# EAGLE design buffer (EAGLE 9.6.2)
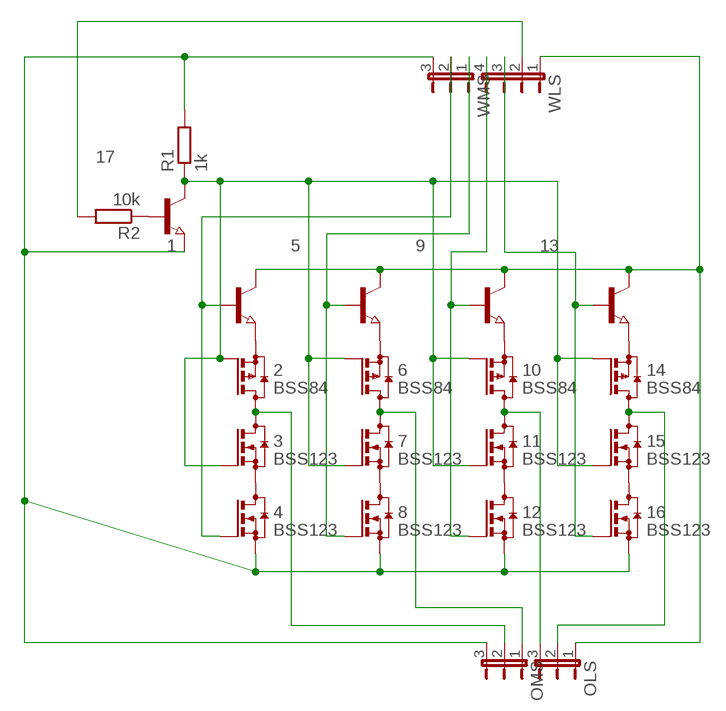
[diagram p0: schematic, sheet 1]

## Parts
1  NPN-TRANSISTOR_SOT23  [SOT23]
2  BSS84  [SOT23]
3  BSS123  [SOT23]
4  BSS123  [SOT23]
5  NPN-TRANSISTOR_SOT23  [SOT23]
6  BSS84  [SOT23]
7  BSS123  [SOT23]
8  BSS123  [SOT23]
9  NPN-TRANSISTOR_SOT23  [SOT23]
10  BSS84  [SOT23]
11  BSS123  [SOT23]
12  BSS123  [SOT23]
13  NPN-TRANSISTOR_SOT23  [SOT23]
14  BSS84  [SOT23]
15  BSS123  [SOT23]
16  BSS123  [SOT23]
17  NPN-TRANSISTOR_SOT23  [SOT23]
OLS  JP2E  [JP2]
OMS  JP2E  [JP2]
R1  1k  R-EU_R1206  [R1206]
R2  10k  R-EU_R1206  [R1206]
WLS  JP4E  [JP4]
WMS  JP2E  [JP2]

## Nets
N$1: 13.2(E) 14.2(S)
N$2: 14.3(D) 15.3(D) OLS.2
N$3: 15.2(S) 16.3(D)
N$4: 1.3(C) 5.3(C) 9.3(C) 13.3(C) OLS.1 WLS.1
N$5: 13.1(B) 16.1(G) WLS.3
N$7: 4.2(S) 8.2(S) 12.2(S) 16.2(S) 17.2(E) OMS.3 R1.2 WMS.3
N$8: 9.2(E) 10.2(S)
N$9: 10.3(D) 11.3(D) OLS.3
N$10: 11.2(S) 12.3(D)
N$11: 9.1(B) 12.1(G) WLS.4
N$13: 5.2(E) 6.2(S)
N$14: 6.3(D) 7.3(D) OMS.1
N$15: 7.2(S) 8.3(D)
N$16: 5.1(B) 8.1(G) WMS.1
N$18: 1.2(E) 2.2(S)
N$19: 2.3(D) 3.3(D) OMS.2
N$20: 3.2(S) 4.3(D)
N$21: 1.1(B) 4.1(G) WMS.2
N$23: 2.1(G) 3.1(G) 6.1(G) 7.1(G) 10.1(G) 11.1(G) 14.1(G) 15.1(G) 17.3(C) R1.1
N$24: 17.1(B) R2.1
N$25: R2.2 WLS.2

## Library data of the parts
1 5 9 13 17 = semicon-smd-ipc:NPN-TRANSISTOR_: NPN TRANSISTOR
2 6 10 14 = transistor-small-signal:BSS84: P-CHANNEL MOS FET
3 4 7 8 11 12 15 16 = transistor-small-signal:BSS123: N-CHANNEL MOS FET
OLS OMS WMS = jumper:JP2E: JUMPER
R1 R2 = rcl:R-EU_: RESISTOR, European symbol; SPICEPREFIX: R
WLS = jumper:JP4E: JUMPER

## Net classes
0 default: width 1.27 mm

## Board
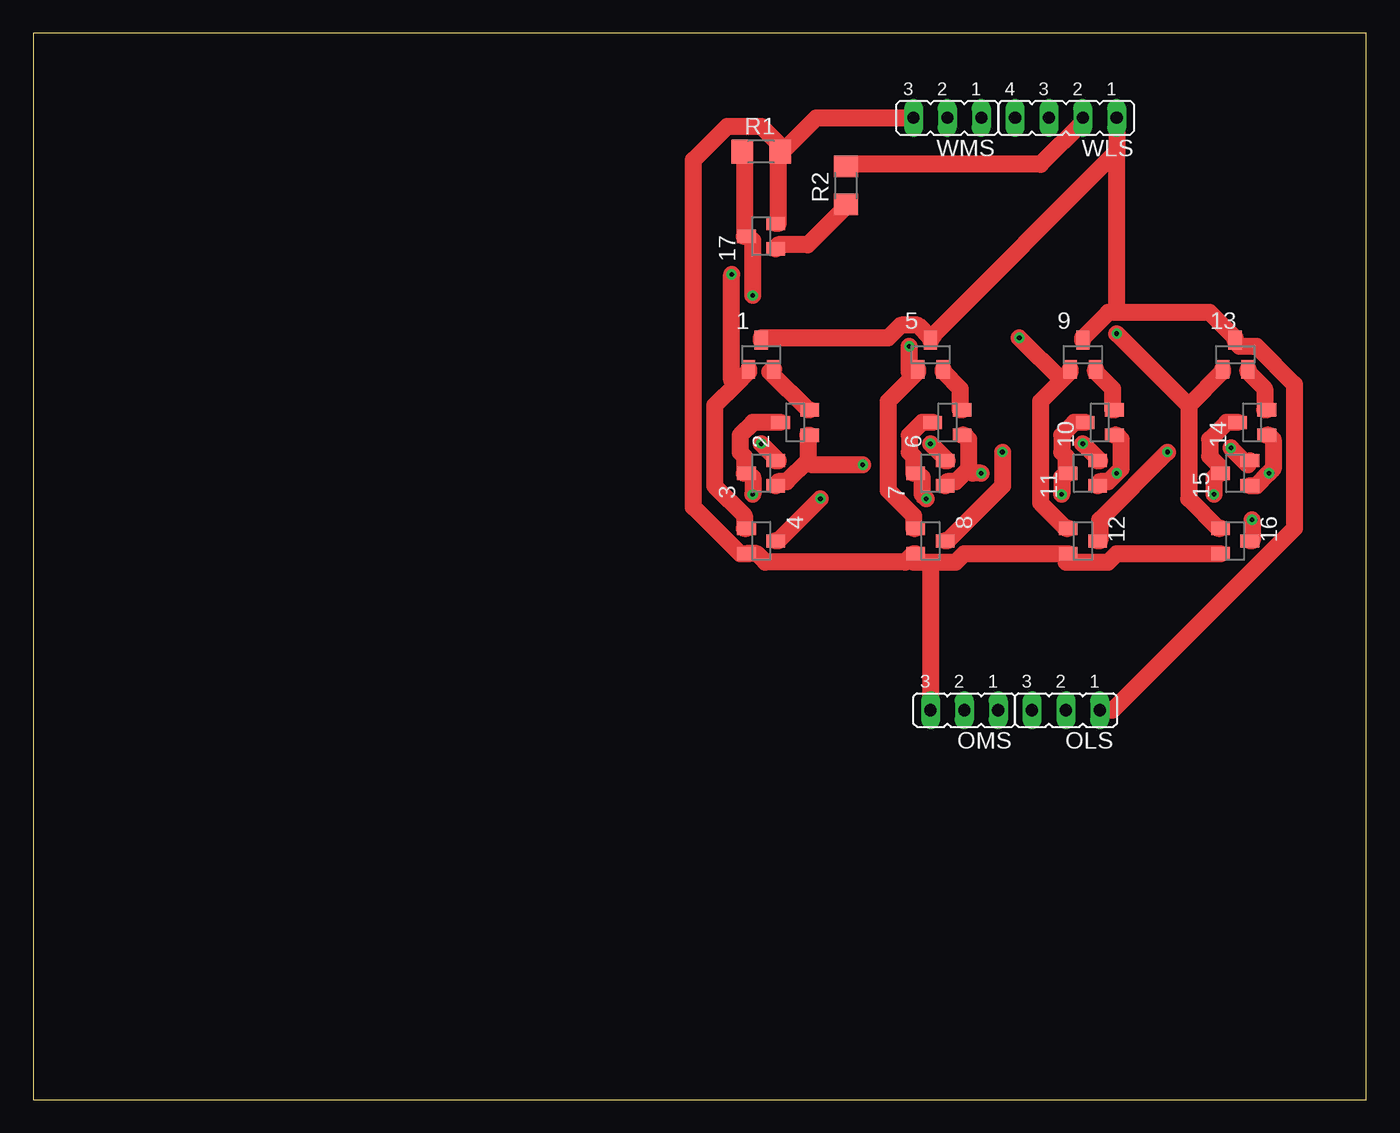
[diagram p1: board, top side]
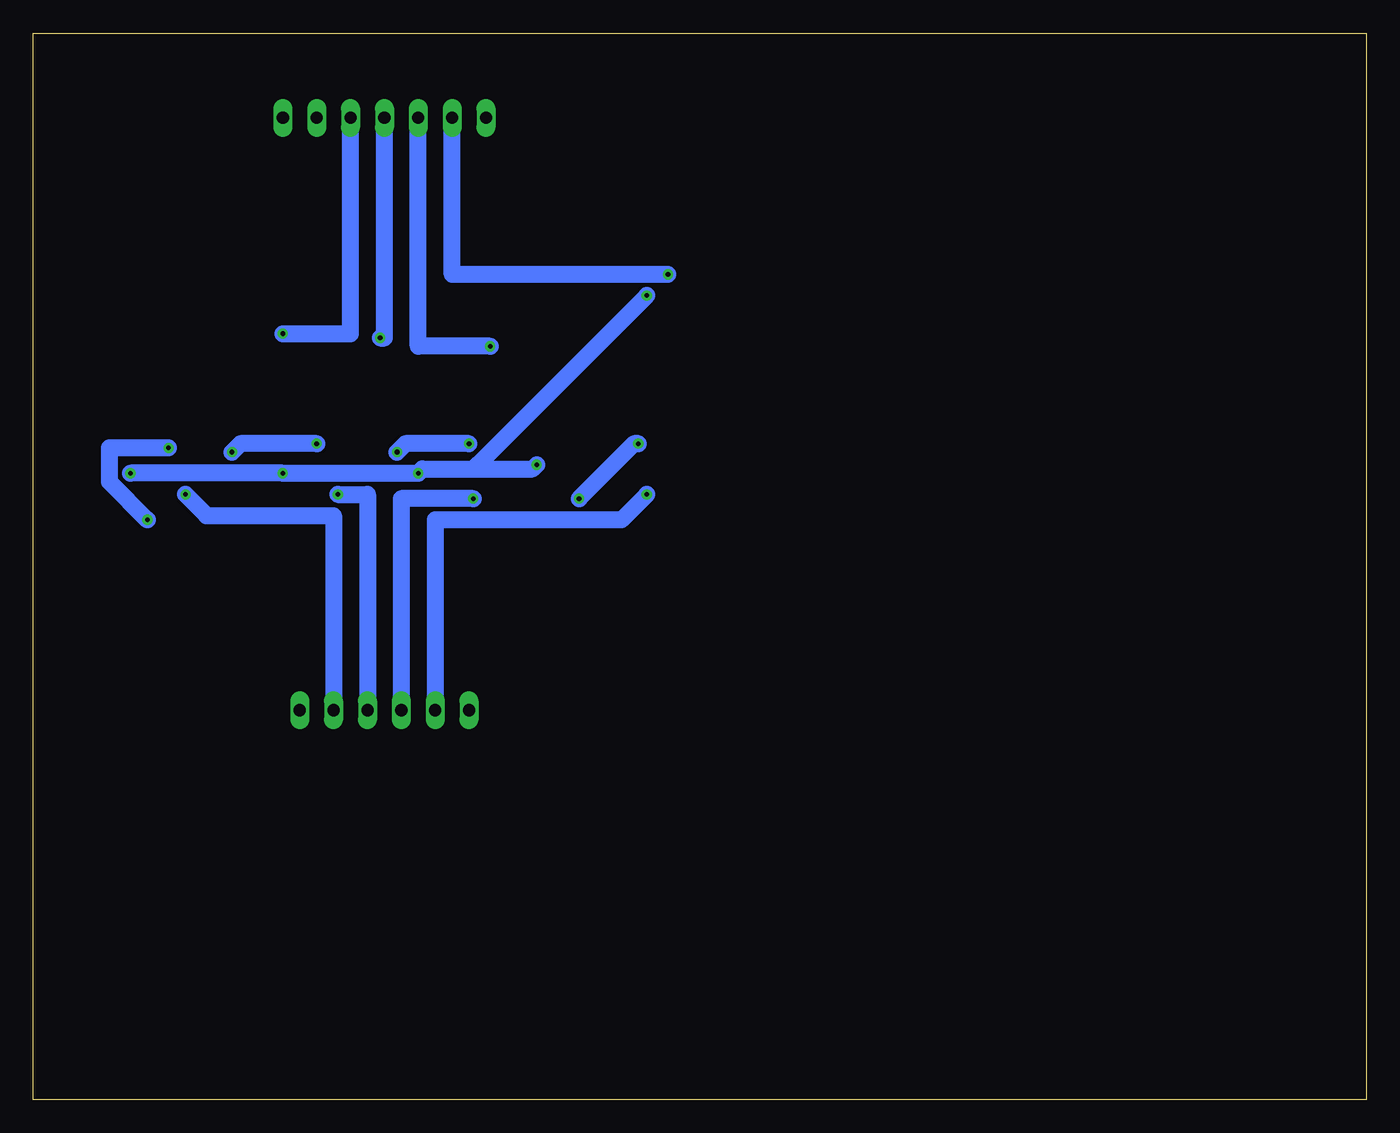
[diagram p2: board, bottom side, seen from below]

Size 100 x 80 mm. Coordinates in mm from the lower left corner, seen from the top.
Outline: 0,0 100,0 100,80 0,80 0,0
Copper layers (1*16): Top 0.035mm / dielectric 1.5mm / Bottom 0.035mm
Design rules "default": minimum track width 6mil, minimum drill 0.35mm, track to track 6mil, track to pad 6mil, pad to pad 6mil, via to via 6mil, smd to smd 6mil, copper to edge 40mil, drill to drill 6mil, minimum pad ring 10mil, minimum via ring 8mil, stop-mask expansion 4mil, vias tented up to drill 0mil, thermal gap 10mil

### Footprints (pad centres in the part's own frame; a part is rotated, then mirrored left to right if it is on the bottom)
SOT23 = smd 1 x 1.4: 1 -0.95,-1.1; 2 0.95,-1.1; 3 0,1.1
JP2 = drill 0.914 long: 1 -2.54,0; 2 0,0; 3 2.54,0
R1206 = smd 1.6 x 1.803: 1 -1.422,0; 2 1.422,0
JP4 = drill 0.914 long: 1 -3.81,0; 2 -1.27,0; 3 1.27,0; 4 3.81,0

### Placement (x,y rotation side)
1  54.61,55.88 0 top
2  57.15,50.8 90 top
3  54.61,46.99 90 top
4  54.61,41.91 270 top
5  67.31,55.88 0 top
6  68.58,50.8 90 top
7  67.31,46.99 90 top
8  67.31,41.91 270 top
9  78.74,55.88 0 top
10  80.01,50.8 90 top
11  78.74,46.99 90 top
12  78.74,41.91 270 top
13  90.17,55.88 0 top
14  91.44,50.8 90 top
15  90.17,46.99 90 top
16  90.17,41.91 270 top
17  54.61,64.77 90 top
OLS  77.47,29.21 180 top
OMS  69.85,29.21 180 top
R1  54.61,71.12 0 top
R2  60.96,68.58 90 top
WLS  77.47,73.66 180 top
WMS  68.58,73.66 180 top

### Tracks (layer width: path | path; a pad name or v marks a point on that pad's centre or on a via)
N$1
  Top 1.27: 14.2 92.39,51.75 92.39,53.34 91.12,54.61 13.2
N$2  (via drill 0.35)
  Top 1.27: 14.3 89.53,50.8 88.27,49.53 88.27,48.26 88.9,47.62 88.9,46.99 15.3 88.58,46.67 v88.58,45.4
  Bottom 1.27: OLS.2 77.47,43.81 87,43.81 v88.58,45.4
N$3  (via drill 0.35)
  Top 1.27: v91.44,43.5 91.44,41.91 16.3 | v89.85,48.9 91.12,47.62 15.2
  Bottom 1.27: v91.44,43.5 94.3,46.35 94.3,48.9 v89.85,48.9
N$4
  Top 1.27: 1.3 54.61,57.15 64.14,57.15 65.09,58.1 66.36,58.1 67.31,57.15 5.3 67.63,57.47 80.96,70.8 81.28,70.8 | 81.28,59.05 88.27,59.05 90.17,57.15 13.3 90.49,56.52 91.76,56.52 94.61,53.66 94.61,42.86 80.96,29.21 OLS.1 | 81.28,59.05 80.64,59.05 78.74,57.15 9.3 | 81.28,59.05 81.28,70.8 | WLS.1 81.28,70.8
N$5  (via drill 0.35)
  Top 1.27: 86.68,52.07 86.68,45.09 88.9,42.86 16.1 | 86.68,52.07 89.22,54.61 13.1 | 86.68,52.07 v81.28,57.47
  Bottom 1.27: WLS.3 76.2,57.47 v81.28,57.47
N$7
  Top 1.27: 17.2 55.88,65.72 55.88,71.12 R1.2 | WMS.3 58.74,73.66 56.52,71.44 R1.2 | 65.72,40.64 66.04,40.96 8.2 | 65.72,40.64 65.41,40.32 54.93,40.32 54.29,40.96 53.66,40.96 4.2 53.02,40.96 49.53,44.45 49.53,70.48 52.07,73.03 54.61,73.03 55.88,71.75 R1.2 | 77.47,40.96 69.85,40.96 69.22,40.32 67.31,40.32 | 67.31,40.32 66.04,40.32 65.72,40.64 | 77.47,40.96 12.2 | 16.2 88.9,40.96 81.28,40.96 80.64,40.32 77.47,40.32 77.47,40.96 | 67.31,40.32 OMS.3
N$8
  Top 1.27: 10.2 80.96,51.75 80.96,53.34 79.69,54.61 9.2
N$9  (via drill 0.35)
  Top 1.27: 10.3 78.11,50.8 77.15,49.85 77.15,48.58 77.47,48.26 77.47,46.99 11.3 77.15,46.67 v77.15,45.4
  Bottom 1.27: OLS.3 74.93,45.4 v77.15,45.4
N$10  (via drill 0.35)
  Top 1.27: v85.09,48.58 80.01,43.5 80.01,41.91 12.3 | v78.74,49.21 80.01,47.94 11.2
  Bottom 1.27: v85.09,48.58 84.45,49.21 v78.74,49.21
N$11  (via drill 0.35)
  Top 1.27: 77.15,53.98 77.79,54.61 9.1 | 77.15,53.98 75.56,52.39 75.56,44.77 77.47,42.86 12.1 | 77.15,53.98 v73.98,57.15
  Bottom 1.27: WLS.4 73.66,57.15 v73.98,57.15
N$13
  Top 1.27: 6.2 69.53,51.75 69.53,53.34 68.26,54.61 5.2
N$14  (via drill 0.35)
  Top 1.27: 6.3 66.67,50.8 65.72,49.85 65.72,48.58 66.04,48.26 66.04,46.99 7.3 66.67,46.67 66.67,45.4 v66.99,45.09
  Bottom 1.27: OMS.1 72.39,45.09 v66.99,45.09
N$15  (via drill 0.35)
  Top 1.27: v72.71,48.58 72.71,46.04 68.58,41.91 8.3 | v67.31,49.21 68.58,47.94 7.2
  Bottom 1.27: v72.71,48.58 72.07,49.21 v67.31,49.21
N$16  (via drill 0.35)
  Top 1.27: 66.04,54.29 66.36,54.61 5.1 | 66.04,54.29 64.14,52.39 64.14,45.72 66.04,43.81 66.04,42.86 8.1 | v65.72,56.52 65.72,54.61 66.04,54.29
  Bottom 1.27: WMS.1 71.12,56.52 v65.72,56.52
N$18
  Top 1.27: 2.2 58.1,51.75 55.24,54.61 1.2
N$19  (via drill 0.35)
  Top 1.27: 2.3 53.98,50.8 53.02,49.85 53.02,48.58 53.34,48.26 53.34,46.99 3.3 53.98,46.67 v53.98,45.4
  Bottom 1.27: OMS.2 69.85,43.5 55.88,43.5 v53.98,45.4
N$20  (via drill 0.35)
  Top 1.27: v59.05,45.09 55.88,41.91 4.3 | v54.61,49.21 55.88,47.94 3.2
  Bottom 1.27: v59.05,45.09 54.93,49.21 v54.61,49.21
N$21  (via drill 0.35)
  Top 1.27: 52.7,53.66 53.66,54.61 1.1 | 52.7,53.66 51.12,52.07 51.12,46.04 53.34,43.81 53.34,42.86 4.1 | v52.39,61.91 52.39,53.98 52.7,53.66
  Bottom 1.27: WMS.2 68.58,61.91 v52.39,61.91
N$23  (via drill 0.35)
  Top 1.27: R1.1 53.34,71.12 53.34,64.77 17.3 53.98,64.45 v53.98,60.33 | 58.1,47.94 56.52,46.35 55.88,46.35 3.1 | 58.1,47.94 58.1,49.85 2.1 | 15.1 91.44,46.04 91.76,46.04 v92.71,46.99 93.03,47.31 93.03,49.53 92.71,49.85 14.1 | 70.17,47.31 69.22,46.35 68.58,46.35 7.1 | 70.17,47.31 70.17,49.53 69.85,49.85 6.1 | 11.1 80.01,46.35 80.64,46.35 v81.28,46.99 81.6,47.31 81.6,49.53 81.28,49.85 10.1 | v71.12,46.99 70.48,46.99 70.17,47.31 | v62.23,47.62 58.42,47.62 58.1,47.94
  Bottom 1.27: v92.71,46.99 v81.28,46.99 v71.12,46.99 70.8,47.31 66.67,47.31 | v62.23,47.62 62.55,47.31 66.67,47.31 | v53.98,60.33 66.67,47.62 66.67,47.31
N$24
  Top 1.27: 17.1 55.88,64.14 58.1,64.14 60.96,66.99 R2.1
N$25
  Top 1.27: WLS.2 78.74,73.34 75.56,70.17 60.96,70.17 R2.2